# EasyEDA Pro project PCB2.eprj

# Board PCB2
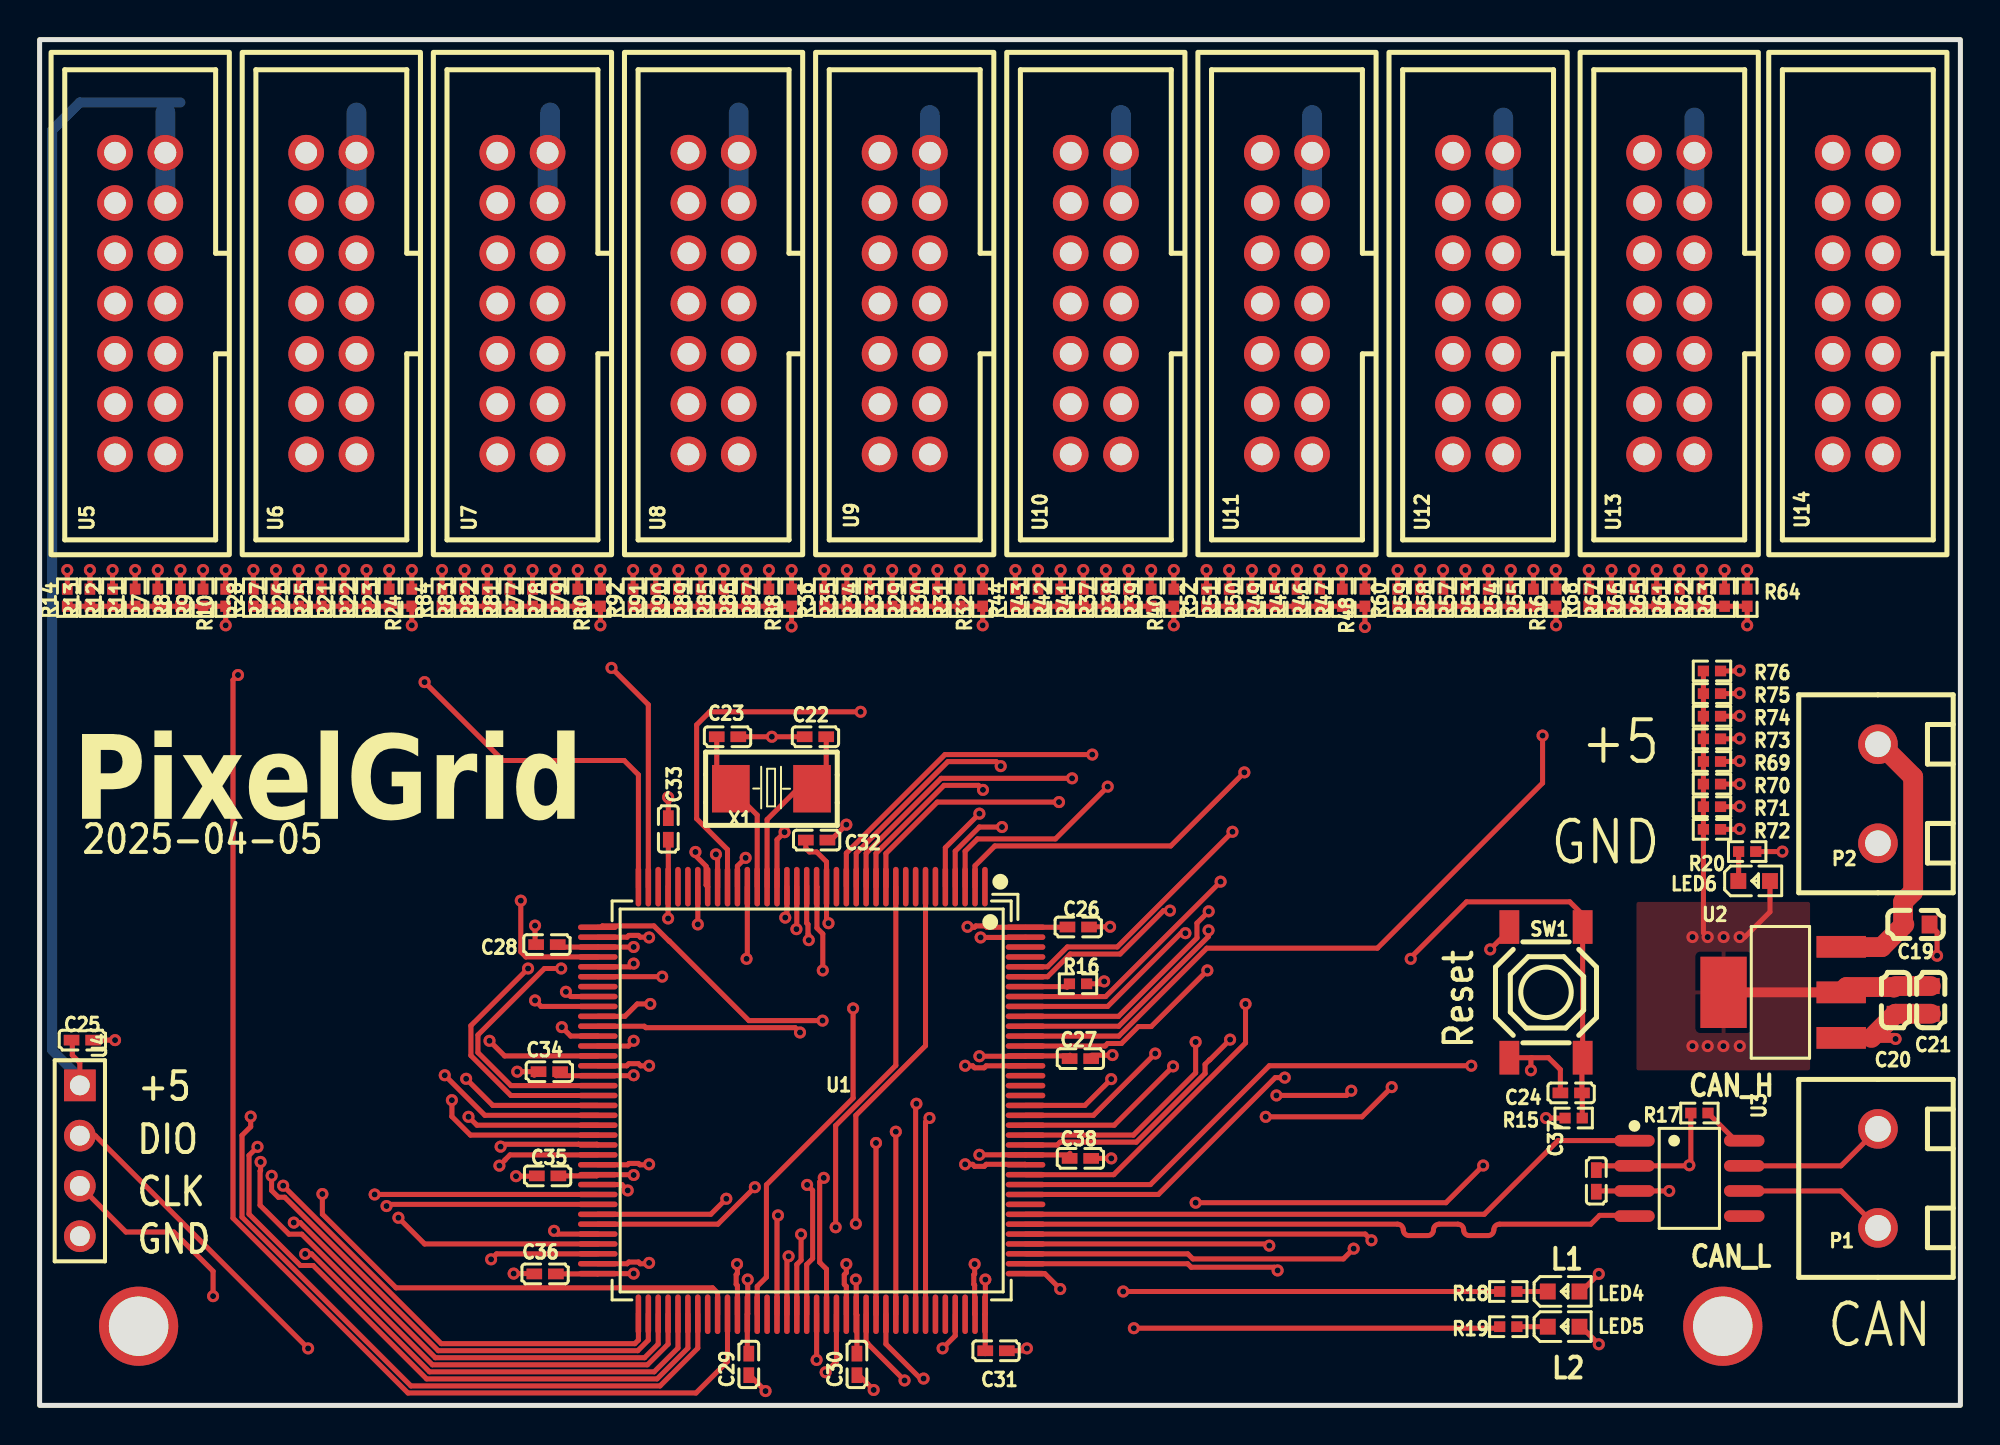
[diagram p0: board, top side]
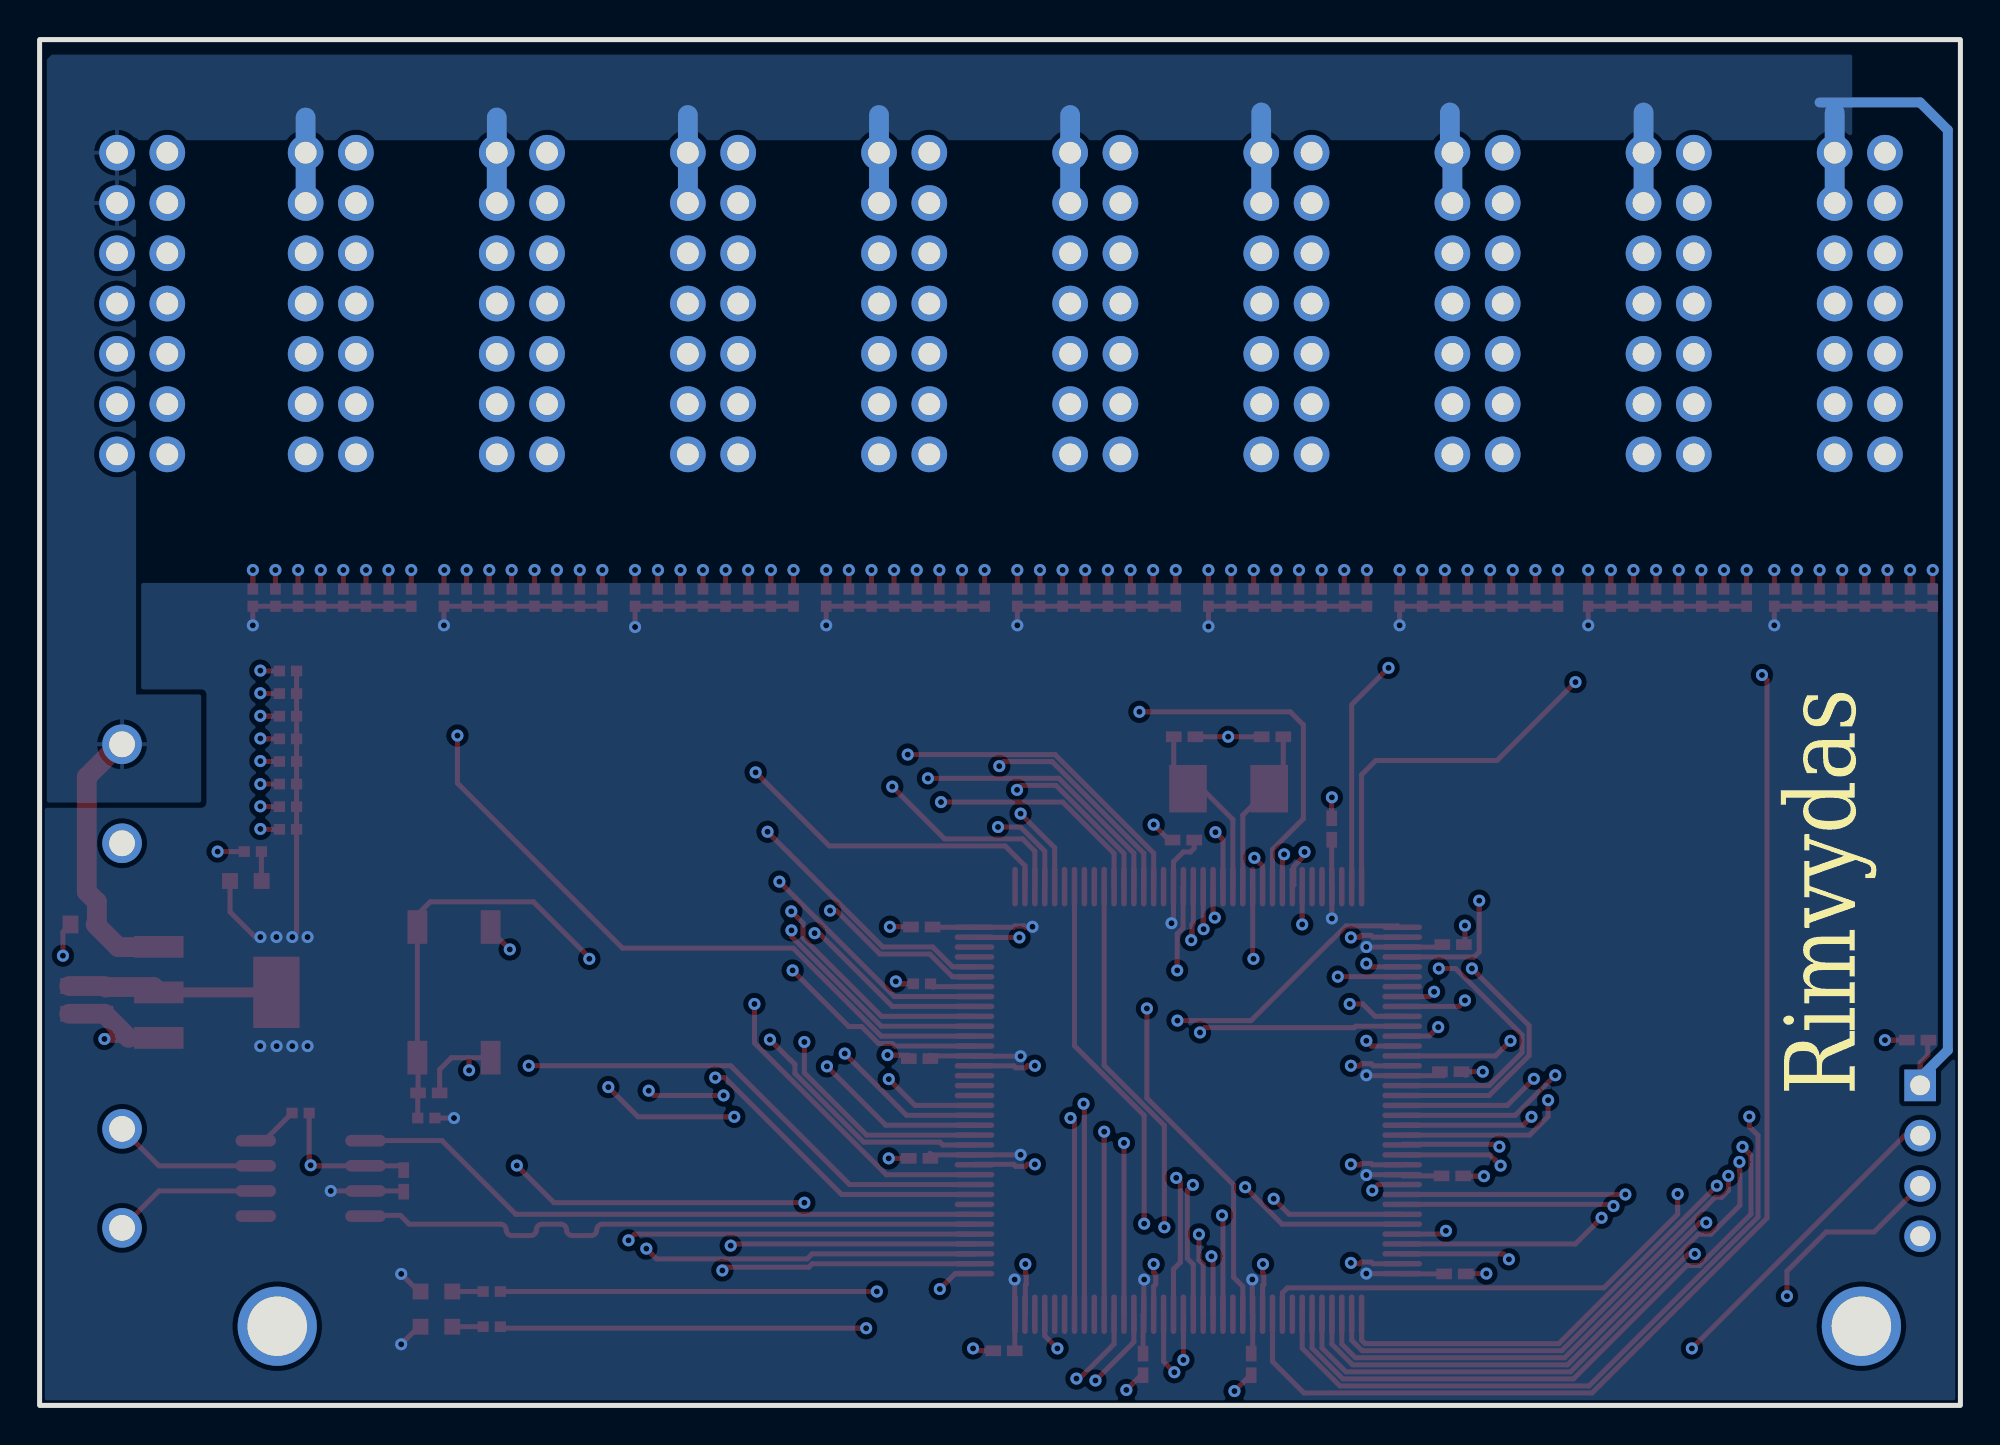
[diagram p1: board, bottom side, seen from below]

Outline 97 x 69 mm; copper layers: Top Layer, Inner1, Inner2, Bottom Layer. Coordinates in mm from the lower left corner of the outline.
Outline path: rectangle 0,69 97,0
Stack: Top Layer 0.035mm Outer layer copper thickness 1oz / Dielectric1 0.2104mm 7628 RC49% 8.6mil / Inner1 0.0152mm Inner layer copper thickness / Dielectric2 1.065mm 1.1mm H/HOZ Copper / Inner2 0.0152mm Inner layer copper thickness / Dielectric3 0.2104mm 7628 RC49% 8.6mil / Bottom Layer 0.035mm Outer layer copper thickness 1oz

## Design rules (mm)
template: JLCPCB Capability(Multiple Layers Board)
spacing copperThickness1oz (default): track to track 0.102, other pairs 0.152 to 0.3
spacing copperThickness2oz: track to track 0.203, other pairs 0.152 to 0.3
spacing copperThicknessInner0.5oz: track to track 0.089, other pairs 0.152 to 0.3
track width copperThickness1oz (default): min 0.102, default 0.254, max 2.54
track width copperThickness2oz: min 0.203, default 0.254, max 2.54
track width copperThickness0.5oz: min 0.089, default 0.254, max 2.54
differential pair differentialPair (default): width min 0.127, default 0.254, max 2.54; gap min 0.152, default 0.152
via viaSize (default): diameter min 0.3, default 0.61, max 10; hole min 0.2, default 0.305, max 6.3

## Placement (name value [footprint] x y rotation side)
C19  10uF  [C0603]  94.74 24.3 0 top
C20  10uF  [C0603]  93.73 20.49 90 top
C21  10uF  [C0603]  95.5 20.49 90 top
C22  20pF  [C0402]  39.18 33.78 0 top
C23  20pF  [C0402]  34.74 33.78 180 top
C24  100nF  [C0402]  77.34 15.79 0 top
C25  100nF  [C0402]  2.16 18.45 180 top
C26  100nF  [C0402]  52.45 24.17 180 top
C27  100nF  [C0402]  52.56 17.52 180 top
C28  100nF  [C0402]  25.62 23.28 0 top
C29  100nF  [C0402]  35.81 2.07 90 top
C30  100nF  [C0402]  41.28 2.07 90 top
C31  100nF  [C0402]  48.3 2.76 180 top
C32  100nF  [C0402]  39.24 28.56 180 top
C33  100nF  [C0402]  31.75 29.12 270 top
C34  100nF  [C0402]  25.74 16.86 0 top
C35  100nF  [C0402]  25.65 11.6 0 top
C36  100nF  [C0402]  25.53 6.64 0 top
C37  100nF  [C0402]  78.61 11.34 270 top
C38  100nF  [C0402]  52.56 12.48 180 top
LED4  KT-0603R  [LED0603-RD]  76.96 5.75 0 top
LED5  KT-0603R  [LED0603-RD]  76.96 3.98 0 top
LED6  KT-0603R  [LED0603-RD]  86.58 26.49 0 top
NOREF  -  [Pad_e2]  85 4 0 top
NOREF#2  -  [Pad_e4]  5 4 0 top
P1  WJ126V-5.0-2P  [CONN-TH_WJ126V-5.0-2P]  92.84 11.47 180 top
P2  WJ126V-5.0-2P  [CONN-TH_WJ126V-5.0-2P]  92.84 30.9 180 top
R7  2kΩ  [R0402]  5.97 40.81 270 top
R8  2kΩ  [R0402]  7.11 40.81 270 top
R9  2kΩ  [R0402]  8.25 40.81 270 top
R10  2kΩ  [R0402]  9.4 40.81 270 top
R11  2kΩ  [R0402]  4.83 40.81 270 top
R12  2kΩ  [R0402]  3.68 40.81 270 top
R13  2kΩ  [R0402]  2.54 40.81 270 top
R14  2kΩ  [R0402]  1.4 40.81 270 top
R15  10kΩ  [R0402]  77.47 14.52 180 top
R16  10kΩ  [R0402]  52.44 21.3 180 top
R17  10kΩ  [R0402]  83.82 14.77 180 top
R18  510Ω  [R0402]  74.17 5.75 0 top
R19  510Ω  [R0402]  74.17 3.98 0 top
R20  510Ω  [R0402]  86.23 27.98 180 top
R21  2kΩ  [R0402]  15.37 40.81 270 top
R22  2kΩ  [R0402]  16.51 40.81 270 top
R23  2kΩ  [R0402]  17.65 40.81 270 top
R24  2kΩ  [R0402]  18.8 40.81 270 top
R25  2kΩ  [R0402]  14.22 40.81 270 top
R26  2kΩ  [R0402]  13.08 40.81 270 top
R27  2kΩ  [R0402]  11.94 40.81 270 top
R28  2kΩ  [R0402]  10.8 40.81 270 top
R29  2kΩ  [R0402]  44.2 40.81 270 top
R30  2kΩ  [R0402]  45.34 40.81 270 top
R31  2kΩ  [R0402]  46.48 40.81 270 top
R32  2kΩ  [R0402]  47.62 40.81 270 top
R33  2kΩ  [R0402]  43.05 40.81 270 top
R34  2kΩ  [R0402]  41.91 40.81 270 top
R35  2kΩ  [R0402]  40.77 40.81 270 top
R36  2kΩ  [R0402]  39.62 40.81 270 top
R37  2kΩ  [R0402]  53.85 40.81 270 top
R38  2kΩ  [R0402]  54.99 40.81 270 top
R39  2kΩ  [R0402]  56.13 40.81 270 top
R40  2kΩ  [R0402]  57.28 40.81 270 top
R41  2kΩ  [R0402]  52.71 40.81 270 top
R42  2kΩ  [R0402]  51.56 40.81 270 top
R43  2kΩ  [R0402]  50.42 40.81 270 top
R44  2kΩ  [R0402]  49.28 40.81 270 top
R45  2kΩ  [R0402]  63.5 40.81 270 top
R46  2kΩ  [R0402]  64.64 40.81 270 top
R47  2kΩ  [R0402]  65.79 40.81 270 top
R48  2kΩ  [R0402]  66.93 40.81 270 top
R49  2kΩ  [R0402]  62.36 40.81 270 top
R50  2kΩ  [R0402]  61.21 40.81 270 top
R51  2kΩ  [R0402]  60.07 40.81 270 top
R52  2kΩ  [R0402]  58.93 40.81 270 top
R53  2kΩ  [R0402]  73.15 40.81 270 top
R54  2kΩ  [R0402]  74.29 40.81 270 top
R55  2kΩ  [R0402]  75.44 40.81 270 top
R56  2kΩ  [R0402]  76.58 40.81 270 top
R57  2kΩ  [R0402]  72.01 40.81 270 top
R58  2kΩ  [R0402]  70.87 40.81 270 top
R59  2kΩ  [R0402]  69.72 40.81 270 top
R60  2kΩ  [R0402]  68.58 40.81 270 top
R61  2kΩ  [R0402]  82.8 40.81 270 top
R62  2kΩ  [R0402]  83.95 40.81 270 top
R63  2kΩ  [R0402]  85.09 40.81 270 top
R64  2kΩ  [R0402]  86.23 40.81 270 top
R65  2kΩ  [R0402]  81.66 40.81 270 top
R66  2kΩ  [R0402]  80.52 40.81 270 top
R67  2kΩ  [R0402]  79.38 40.81 270 top
R68  2kΩ  [R0402]  78.23 40.81 270 top
R69  2kΩ  [R0402]  84.46 32.53 180 top
R70  2kΩ  [R0402]  84.46 31.39 180 top
R71  2kΩ  [R0402]  84.46 30.25 180 top
R72  2kΩ  [R0402]  84.46 29.1 180 top
R73  2kΩ  [R0402]  84.46 33.67 180 top
R74  2kΩ  [R0402]  84.46 34.82 180 top
R75  2kΩ  [R0402]  84.46 35.96 180 top
R76  2kΩ  [R0402]  84.46 37.1 180 top
R77  2kΩ  [R0402]  24.89 40.81 270 top
R78  2kΩ  [R0402]  26.03 40.81 270 top
R79  2kΩ  [R0402]  27.18 40.81 270 top
R80  2kΩ  [R0402]  28.32 40.81 270 top
R81  2kΩ  [R0402]  23.75 40.81 270 top
R82  2kΩ  [R0402]  22.61 40.81 270 top
R83  2kΩ  [R0402]  21.46 40.81 270 top
R84  2kΩ  [R0402]  20.32 40.81 270 top
R85  2kΩ  [R0402]  34.54 40.81 270 top
R86  2kΩ  [R0402]  35.69 40.81 270 top
R87  2kΩ  [R0402]  36.83 40.81 270 top
R88  2kΩ  [R0402]  37.97 40.81 270 top
R89  2kΩ  [R0402]  33.4 40.81 270 top
R90  2kΩ  [R0402]  32.26 40.81 270 top
R91  2kΩ  [R0402]  31.12 40.81 270 top
R92  2kΩ  [R0402]  29.97 40.81 270 top
SW1  TS-1187A-B-A-B  [SW-SMD_4P-L5.1-W5.1-P3.70-LS6.5-TL-2]  76.07 20.87 90 top
U1  STM32F103ZET6  [LQFP-144_L20.0-W20.0-P0.50-LS22.0-BL]  38.99 15.41 180 top
U2  AMS1117-3.3  [SOT-223-3_L6.5-W3.4-P2.30-LS7.0-BR]  88.01 20.87 0 top
U3  SN65HVD230DR  [SOIC-8_L4.9-W3.9-P1.27-LS6.0-BL]  83.31 11.47 270 top
U4  HDGCPH-PZ01-04  [HDR-TH_4P-P2.54-V-M_1]  2.03 12.36 270 top
U5  HY2541WV-N-2X7P  [HDR-TH_14P-P2.54-V-F-R2-C7-S2.54-2]  5.08 55.67 90 top
U6  HY2541WV-N-2X7P  [HDR-TH_14P-P2.54-V-F-R2-C7-S2.54-2]  14.73 55.67 90 top
U7  HY2541WV-N-2X7P  [HDR-TH_14P-P2.54-V-F-R2-C7-S2.54-2]  24.38 55.67 90 top
U8  HY2541WV-N-2X7P  [HDR-TH_14P-P2.54-V-F-R2-C7-S2.54-2]  34.04 55.67 90 top
U9  HY2541WV-N-2X7P  [HDR-TH_14P-P2.54-V-F-R2-C7-S2.54-2]  43.69 55.67 90 top
U10  HY2541WV-N-2X7P  [HDR-TH_14P-P2.54-V-F-R2-C7-S2.54-2]  53.34 55.67 90 top
U11  HY2541WV-N-2X7P  [HDR-TH_14P-P2.54-V-F-R2-C7-S2.54-2]  62.99 55.67 90 top
U12  HY2541WV-N-2X7P  [HDR-TH_14P-P2.54-V-F-R2-C7-S2.54-2]  72.64 55.67 90 top
U13  HY2541WV-N-2X7P  [HDR-TH_14P-P2.54-V-F-R2-C7-S2.54-2]  82.3 55.67 90 top
U14  HY2541WV-N-2X7P  [HDR-TH_14P-P2.54-V-F-R2-C7-S2.54-2]  91.82 55.67 90 top
X1  8MHz  [CRYSTAL-SMD_L5.0-W3.2]  36.96 31.15 180 top

## Footprints (pads in the part's own frame, mm; a bottom-side part is the same pattern mirrored in y, then rotated)
C0402
  rect 0.79x0.54 smd: 1(-0.545,0) 2(0.545,0)
C0603
  rect 0.8x0.9 smd: 1(-0.7,0) 2(0.7,0)
CONN-TH_WJ126V-5.0-2P
  round 2 hole 1.3: 1(0,2.501) 2(0,-2.501)
CRYSTAL-SMD_L5.0-W3.2
  rect 1.9x2.4 smd: 1(-2.05,0) 2(2.05,0)
HDR-TH_4P-P2.54-V-M_1
  rect 1.6x1.6 hole 1: 1(-3.81,0)
  round 1.6 hole 1: 2(-1.27,0) 3(1.27,0) 4(3.81,0)
HDR-TH_14P-P2.54-V-F-R2-C7-S2.54-2
  round 1.8 hole 1.1: 1(-7.62,-1.27) 2(-7.62,1.27) 3(-5.08,-1.27) 4(-5.08,1.27) 5(-2.54,-1.27) 6(-2.54,1.27) 7(0,-1.27) 8(0,1.27) 9(2.54,-1.27) 10(2.54,1.27) 11(5.08,-1.27) 12(5.08,1.27) 13(7.62,-1.27) 14(7.62,1.27)
LED0603-RD
  rect 0.8x0.8 smd: 1(-0.799,0) 2(0.799,0)
LQFP-144_L20.0-W20.0-P0.50-LS22.0-BL
  oval 0.28x2 smd: 1(-8.75,-10.8) 2(-8.25,-10.8) 3(-7.75,-10.8) 4(-7.25,-10.8) 5(-6.75,-10.8) 6(-6.25,-10.8) 7(-5.75,-10.8) 8(-5.25,-10.8) 9(-4.75,-10.8) 10(-4.25,-10.8) 11(-3.75,-10.8) 12(-3.25,-10.8) 13(-2.75,-10.8) 14(-2.25,-10.8) 15(-1.75,-10.8) 16(-1.25,-10.8) 17(-0.75,-10.8) 18(-0.25,-10.8) 19(0.25,-10.8) 20(0.75,-10.8) 21(1.25,-10.8) 22(1.75,-10.8) 23(2.25,-10.8) 24(2.75,-10.8) 25(3.25,-10.8) 26(3.75,-10.8) 27(4.25,-10.8) 28(4.75,-10.8) 29(5.25,-10.8) 30(5.75,-10.8) 31(6.25,-10.8) 32(6.75,-10.8) 33(7.25,-10.8) 34(7.75,-10.8) 35(8.25,-10.8) 36(8.75,-10.8) 73(8.75,10.8) 74(8.25,10.8) 75(7.75,10.8) 76(7.25,10.8) 77(6.75,10.8) 78(6.25,10.8) 79(5.75,10.8) 80(5.25,10.8) 81(4.75,10.8) 82(4.25,10.8) 83(3.75,10.8) 84(3.25,10.8) 85(2.75,10.8) 86(2.25,10.8) 87(1.75,10.8) 88(1.25,10.8) 89(0.75,10.8) 90(0.25,10.8) 91(-0.25,10.8) 92(-0.75,10.8) 93(-1.25,10.8) 94(-1.75,10.8) 95(-2.25,10.8) 96(-2.75,10.8) 97(-3.25,10.8) 98(-3.75,10.8) 99(-4.25,10.8) 100(-4.75,10.8) 101(-5.25,10.8) 102(-5.75,10.8) 103(-6.25,10.8) 104(-6.75,10.8) 105(-7.25,10.8) 106(-7.75,10.8) 107(-8.25,10.8) 108(-8.75,10.8)
  oval 2x0.28 smd: 37(10.8,-8.75) 38(10.8,-8.25) 39(10.8,-7.75) 40(10.8,-7.25) 41(10.8,-6.75) 42(10.8,-6.25) 43(10.8,-5.75) 44(10.8,-5.25) 45(10.8,-4.75) 46(10.8,-4.25) 47(10.8,-3.75) 48(10.8,-3.25) 49(10.8,-2.75) 50(10.8,-2.25) 51(10.8,-1.75) 52(10.8,-1.25) 53(10.8,-0.75) 54(10.8,-0.25) 55(10.8,0.25) 56(10.8,0.75) 57(10.8,1.25) 58(10.8,1.75) 59(10.8,2.25) 60(10.8,2.75) 61(10.8,3.25) 62(10.8,3.75) 63(10.8,4.25) 64(10.8,4.75) 65(10.8,5.25) 66(10.8,5.75) 67(10.8,6.25) 68(10.8,6.75) 69(10.8,7.25) 70(10.8,7.75) 71(10.8,8.25) 72(10.8,8.75) 109(-10.8,8.75) 110(-10.8,8.25) 111(-10.8,7.75) 112(-10.8,7.25) 113(-10.8,6.75) 114(-10.8,6.25) 115(-10.8,5.75) 116(-10.8,5.25) 117(-10.8,4.75) 118(-10.8,4.25) 119(-10.8,3.75) 120(-10.8,3.25) 121(-10.8,2.75) 122(-10.8,2.25) 123(-10.8,1.75) 124(-10.8,1.25) 125(-10.8,0.75) 126(-10.8,0.25) 127(-10.8,-0.25) 128(-10.8,-0.75) 129(-10.8,-1.25) 130(-10.8,-1.75) 131(-10.8,-2.25) 132(-10.8,-2.75) 133(-10.8,-3.25) 134(-10.8,-3.75) 135(-10.8,-4.25) 136(-10.8,-4.75) 137(-10.8,-5.25) 138(-10.8,-5.75) 139(-10.8,-6.25) 140(-10.8,-6.75) 141(-10.8,-7.25) 142(-10.8,-7.75) 143(-10.8,-8.25) 144(-10.8,-8.75)
Pad_e2
  round 4 hole 3: 1(0,0)
Pad_e4
  round 4 hole 3: 1(0,0)
R0402
  rect 0.566x0.54 smd: 1(-0.433,0) 2(0.433,0)
SOIC-8_L4.9-W3.9-P1.27-LS6.0-BL
  oval 0.588x2.045 smd: 1(-1.905,-2.772) 2(-0.635,-2.772) 3(0.635,-2.772) 4(1.905,-2.772) 5(1.905,2.772) 6(0.635,2.772) 7(-0.635,2.772) 8(-1.905,2.772)
SOT-223-3_L6.5-W3.4-P2.30-LS7.0-BR
  rect 2.5x1.1 smd: 1(2.97,-2.3) 2(2.97,0) 3(2.97,2.3)
  rect 2.34x3.6 smd: 4(-2.97,0)
SW-SMD_4P-L5.1-W5.1-P3.70-LS6.5-TL-2
  rect 1.7x1 smd: 1(-3.3,1.85) 2(3.3,1.85) 3(-3.3,-1.85) 4(3.3,-1.85)

## Nets
GND: C19.2 C20.1 C21.1 C22.1 C23.1 C24.1 C25.1 C26.1 C27.1 C28.1 C29.1 C30.1 C31.1 C32.1 C33.1 C34.1 C35.1 C36.1 C37.1 C38.1 P2.1 R16.1 R17.2 R20.1 SW1.1 SW1.2 U1.30 U1.38 U1.51 U1.61 U1.71 U1.83 U1.94 U1.107 U1.120 U1.130 U1.143 U2.1 U3.2 U4.4 U5.12 U5.14 U6.12 U6.14 U7.12 U7.14 U8.12 U8.14 U9.12 U9.14 U10.12 U10.14 U11.12 U11.14 U12.12 U12.14 U13.12 U13.14 U14.12 U14.14
VCC3V3: C20.2 C21.2 C26.2 C27.2 C28.2 C29.2 C30.2 C31.2 C32.2 C33.2 C34.2 C35.2 C36.2 C37.2 C38.2 LED4.2 LED5.2 LED6.2 R7.2 R8.2 R9.2 R10.2 R11.2 R12.2 R13.2 R14.2 R15.2 R21.2 R22.2 R23.2 R24.2 R25.2 R26.2 R27.2 R28.2 R29.2 R30.2 R31.2 R32.2 R33.2 R34.2 R35.2 R36.2 R37.2 R38.2 R39.2 R40.2 R41.2 R42.2 R43.2 R44.2 R45.2 R46.2 R47.2 R48.2 R49.2 R50.2 R51.2 R52.2 R53.2 R54.2 R55.2 R56.2 R57.2 R58.2 R59.2 R60.2 R61.2 R62.2 R63.2 R64.2 R65.2 R66.2 R67.2 R68.2 R69.2 R70.2 R71.2 R72.2 R73.2 R74.2 R75.2 R76.2 R77.2 R78.2 R79.2 R80.2 R81.2 R82.2 R83.2 R84.2 R85.2 R86.2 R87.2 R88.2 R89.2 R90.2 R91.2 R92.2 U1.17 U1.33 U1.39 U1.52 U1.62 U1.72 U1.84 U1.95 U1.108 U1.121 U1.131 U1.144 U2.2 U2.4 U3.3
VCC5V: C19.1 C25.2 P2.2 U2.3 U4.1 U5.11 U5.13 U6.11 U6.13 U7.11 U7.13 U8.11 U8.13 U9.11 U9.13 U10.11 U10.13 U11.11 U11.13 U12.11 U12.13 U13.11 U13.13 U14.11 U14.13
BOOT0: R16.2 U1.138
CAN_RX: U1.114 U3.4
CAN_TX: U1.115 U3.1
L1_IN: U1.82 U5.9
L1_OUT: U5.10
L2_IN: U1.36 U6.9
L2_OUT: U6.10
L3_IN: U1.35 U7.9
L3_OUT: U7.10
L4_IN: U1.42 U8.9
L4_OUT: U8.10
L5_IN: U1.46 U9.9
L5_OUT: U9.10
L6_IN: U1.47 U10.9
L6_OUT: U10.10
L7_IN: U1.85 U11.9
L7_OUT: U11.10
L8_IN: U1.37 U12.9
L8_OUT: U12.10
L9_IN: U1.99 U13.9
L9_OUT: U13.10
L10_IN: U1.96 U14.9
L10_OUT: U14.10
LED1: R18.1 U1.7
LED2: R19.1 U1.10
OSC_IN: C22.2 U1.23 X1.1
OSC_OUT: C23.2 U1.24 X1.2
R1_1: R10.1 U1.81 U5.7
R1_2: R14.1 U1.79 U5.8
R2_1: R9.1 U1.77 U5.5
R2_2: R13.1 U1.78 U5.6
R3_1: R8.1 U1.75 U5.3
R3_2: R12.1 U1.76 U5.4
R4_1: R7.1 U1.73 U5.1
R4_2: R11.1 U1.74 U5.2
R5_1: R24.1 U1.87 U6.7
R5_2: R28.1 U1.88 U6.8
R6_1: R23.1 U1.89 U6.5
R6_2: R27.1 U1.70 U6.6
R7_1: R22.1 U1.69 U6.3
R7_2: R26.1 U1.68 U6.4
R8_1: R21.1 U1.65 U6.1
R8_2: R25.1 U1.64 U6.2
R9_1: R80.1 U1.63 U7.7
R9_2: R84.1 U1.60 U7.8
R10_1: R79.1 U1.59 U7.5
R10_2: R83.1 U1.58 U7.6
R11_1: R78.1 U1.57 U7.3
R11_2: R82.1 U1.56 U7.4
R12_1: R77.1 U1.55 U7.1
R12_2: R81.1 U1.50 U7.2
R13_1: R88.1 U1.49 U8.7
R13_2: R92.1 U1.48 U8.8
R14_1: R87.1 U1.41 U8.5
R14_2: R91.1 U1.40 U8.6
R15_1: R86.1 U1.44 U8.3
R15_2: R90.1 U1.45 U8.4
R16_1: R85.1 U1.53 U8.1
R16_2: R89.1 U1.54 U8.2
R17_1: R32.1 U1.19 U9.7
R17_2: R36.1 U1.20 U9.8
R18_1: R31.1 U1.21 U9.5
R18_2: R35.1 U1.22 U9.6
R19_1: R30.1 U1.26 U9.3
R19_2: R34.1 U1.27 U9.4
R20_1: R29.1 U1.28 U9.1
R20_2: R33.1 U1.29 U9.2
R21_1: R40.1 U1.15 U10.7
R21_2: R44.1 U1.18 U10.8
R22_1: R39.1 U1.13 U10.5
R22_2: R43.1 U1.14 U10.6
R23_1: R38.1 U1.11 U10.3
R23_2: R42.1 U1.12 U10.4
R24_1: R37.1 U1.4 U10.1
R24_2: R41.1 U1.5 U10.2
R25_1: R48.1 U1.2 U11.7
R25_2: R52.1 U1.3 U11.8
R26_1: R47.1 U1.140 U11.5
R26_2: R51.1 U1.139 U11.6
R27_1: R46.1 U1.137 U11.3
R27_2: R50.1 U1.136 U11.4
R28_1: R45.1 U1.135 U11.1
R28_2: R49.1 U1.134 U11.2
R29_1: R56.1 U1.133 U12.7
R29_2: R60.1 U1.132 U12.8
R30_1: R55.1 U1.126 U12.5
R30_2: R59.1 U1.125 U12.6
R31_1: R54.1 U1.124 U12.3
R31_2: R58.1 U1.123 U12.4
R32_1: R53.1 U1.122 U12.1
R32_2: R57.1 U1.119 U12.2
R33_1: R64.1 U1.118 U13.7
R33_2: R68.1 U1.117 U13.8
R34_1: R63.1 U1.113 U13.5
R34_2: R67.1 U1.112 U13.6
R35_1: R62.1 U1.111 U13.3
R35_2: R66.1 U1.110 U13.4
R36_1: R61.1 U1.102 U13.1
R36_2: R65.1 U1.101 U13.2
R37_1: R72.1 U1.98 U14.7
R37_2: R76.1 U1.97 U14.8
R38_1: R71.1 U1.93 U14.5
R38_2: R75.1 U1.92 U14.6
R39_1: R70.1 U1.91 U14.3
R39_2: R74.1 U1.90 U14.4
R40_1: R69.1 U1.66 U14.1
R40_2: R73.1 U1.67 U14.2
RESET: C24.2 R15.1 SW1.3 SW1.4 U1.25
SWCLK: U1.109 U4.3
SWDIO: U1.105 U4.2
$2N2: R17.1 U3.8
$2N4: P1.2 U3.7
$2N5: P1.1 U3.6
$2N12387: LED4.1 R18.2
$2N12392: LED5.1 R19.2
$2N12397: LED6.1 R20.2

Pads without a net: NOREF 1; NOREF#2 1; U1 1 6 8 9 16 31 32 34 43 80 86 100 103 104 106 116 127 128 129 141 142; U3 5

## Via types
v1: diameter 0.61, hole 0.305, Top Layer to Bottom Layer, 251 vias

## Routing (per net, layer and track width the routed paths; a pad name or vN(x,y) marks a point on that pad's centre or on a via; arc(x,y) is an arc through that point)
GND: length 70.4
  Top Layer w0.254: v1(95.82,22.72) 95.82,23.92 C19.2 ; v1(30.78,23.64) 30.76,23.66 30.33,23.66 30.24,23.74 29.76,23.74 29.67,23.66 U1.38 ; C23.1 36.84,33.78 ; v1(24.12,16.86) 24.98,16.86 24.98,16.68 ; 75.35,17.56 76.2,17.56 76.8,16.97 C24.1 ; 75.35,17.56 74.22,17.56 SW1.1 ; 75.35,17.56 75.31,17.53 v1(75.31,16.93) ; 25.11,23.15 25.02,23.24 v1(25.02,24.24) ; v1(42.12,0.78) 41.37,1.53 C30.1 ; C31.1 49.74,2.76 v1(49.86,2.88) ; v1(40.74,7.14) 40.74,6.71 40.64,6.6 40.64,6.12 40.74,6.01 40.74,4.61 ; U1.51 29.65,17.16 29.76,17.26 30.24,17.26 30.35,17.16 30.78,17.16 v1(30.78,17.16) ; C36.1 24.97,6.66 v1(23.94,6.66) ; U1.83 35.24,6.06 35.18,6.12 35.18,6.6 35.24,6.66 35.24,7.12 v1(35.22,7.14) ; v1(73.25,23.04) 74.22,24 SW1.2 ; v1(54.18,17.7) 54.17,17.69 53.12,17.69 ; 49.79,23.66 49.77,23.64 v1(47.52,23.64) ; C35.1 25.09,11.58 v1(24.06,11.58) ; C33.1 31.75,30.71 v1(31.74,30.72) ; v1(30.78,7.2) 30.74,7.16 30.33,7.16 30.24,7.24 29.76,7.24 29.67,7.16 U1.71 ; C37.1 78.83,12.1 U3.2 83.28,12.1 v1(83.31,12.13) 83.39,12.21 R17.2 ; C38.1 v1(54.12,12.48) ; v1(36.66,0.72) 35.86,1.53 C29.1 ; C22.1 v1(36.98,33.78) ; 49.79,12.16 49.76,12.18 47.81,12.18 47.7,12.08 47.22,12.08 47.11,12.18 v1(46.74,12.18) ; v1(3.81,18.45) C25.1 ; v1(40.74,29.34) 39.96,28.56 C32.1 ; R16.1 53.64,21.3 v1(53.76,21.42) ; 33.24,26.2 v1(33.24,24.3) ; v1(30.78,12.18) 30.76,12.16 30.31,12.16 30.24,12.22 29.76,12.22 29.69,12.16 U1.61 ; R20.1 v1(88.01,27.98) ; 49.79,17.16 47.8,17.16 47.7,17.06 47.22,17.06 47.12,17.16 46.74,17.16 v1(46.74,17.16) ; v1(47.22,7.14) 47.22,6.65 47.18,6.6 47.18,6.12 47.22,6.07 47.22,4.62 U1.107 ; C26.1 53.01,24.18 v1(54.06,24.18)
  Top Layer w0.5: v1(93.73,18.51) 93.67,18.57 U2.1
  Top Layer w1: C21.1 C20.1 92.51,18.57
VCC3V3: length 165.6
  Top Layer w0.254: R76.2 84.02,23.88 v1(84.24,23.66) ; v1(35.76,6.36) 35.76,4.63 U1.84 35.74,2.69 C29.2 ; v1(86.23,39.41) R64.2 R63.2 R62.2 R61.2 R65.2 R66.2 R67.2 R68.2 ; C32.2 38.69,28.14 38.88,27.96 39.24,27.96 39.74,27.46 U1.17 39.74,24.46 v1(39.84,24.36) ; 47.75,2.62 47.75,4.59 U1.108 47.76,4.63 v1(47.76,6.36) ; v1(76.58,39.41) R56.2 R55.2 R54.2 R53.2 R57.2 R58.2 R59.2 R60.2 ; C35.2 28.13,11.6 U1.62 29.98,11.66 v1(30,11.64) ; R92.2 R91.2 R90.2 R89.2 R85.2 R86.2 R87.2 R88.2 37.97,39.54 ; R28.2 R27.2 R26.2 R25.2 R21.2 R22.2 R23.2 R24.2 v1(18.8,39.41) ; v1(46.86,24.18) 46.88,24.16 47.21,24.16 47.28,24.22 47.76,24.22 47.83,24.16 51.89,24.16 C26.2 ; LED4.2 77.85,5.75 v1(78.74,6.64) ; v1(28.32,39.41) R80.2 R79.2 R78.2 R77.2 R81.2 R82.2 R83.2 R84.2 ; R14.2 R13.2 R12.2 R11.2 R7.2 R8.2 R9.2 R10.2 v1(9.4,39.41) ; v1(41.22,6.36) 41.24,6.34 U1.95 41.28,4.57 C30.2 ; 26.07,16.68 26.09,16.66 U1.52 29.98,16.66 v1(30,16.68) ; v1(57.28,39.41) R40.2 R39.2 R38.2 R37.2 R41.2 R42.2 R43.2 R44.2 ; LED6.2 87.38,24.93 86.11,23.66 v1(85.85,23.66) ; 66.93,39.54 R48.2 R47.2 R46.2 R45.2 R49.2 R50.2 R51.2 R52.2 ; v1(78.74,3.09) 77.85,3.98 LED5.2 ; C33.2 31.75,26.22 U1.33 ; C37.2 78.65,10.83 U3.3 v1(82.3,10.83) ; v1(47.46,17.64) 49.77,17.64 49.79,17.66 52,17.66 52.03,17.69 ; v1(30,6.66) 30,6.66 U1.72 28.18,6.64 C36.2 ; v1(47.62,39.41) R32.2 R31.2 R30.2 R29.2 R33.2 R34.2 R35.2 R36.2 ; v1(30,23.16) 30,23.16 U1.39 28.19,23.15 26.2,23.15 ; R15.2 v1(76.07,14.52) ; 52.03,12.74 51.95,12.66 49.79,12.66 49.78,12.66 v1(47.46,12.66) ; v1(31.74,24.6) 31.74,26.2
  Top Layer w0.5: U2.4 U2.2 ; C20.2 93.65,21.11
  Top Layer w1: 93.65,21.11 93.62,21.14 91.25,21.14 U2.2 ; C21.2 C20.2
  vias: v1(37.97,39.35) v1(66.93,39.32) v1(83.47,23.66) v1(83.47,18.15) v1(84.24,18.15) v1(85.04,23.66) v1(85.03,18.15) v1(85.86,18.15)
VCC5V: length 112.5
  Top Layer w0.254: U4.1 2.03,17.31 1.65,17.69 1.65,18.56 1.67,18.58
  Top Layer w1: U2.3 91,23.15 93.03,23.15 94.17,24.3 ; P2.2 92.96,33.4 94.62,31.75 94.62,25.95 94.11,25.44 94.11,24.36
  Bottom Layer w0.5: 7.11,65.83 2.03,65.83 0.64,64.43 0.64,17.95 1.91,16.68 1.91,16.3 U4.1
  Bottom Layer w1: U10.11 54.61,65.19 ; U6.11 16,65.32 ; U11.11 64.26,65.19 ; 83.57,65.06 U13.11 ; U7.11 25.65,63.28 25.78,63.41 25.78,65.32 ; 44.96,65.19 U9.11 ; 35.31,65.32 U8.11 ; U12.11 73.91,65.06 ; U5.11 6.35,65.32
BOOT0: length 2.1
  Top Layer w0.254: 49.79,21.16 51.86,21.16 51.89,21.12
CAN_RX: length 32.3
  Top Layer w0.254: U3.4 80.5,9.6 78.78,9.6 78.34,9.16 73.73,9.16 arc(73.52,9.07) 73.44,8.87 arc(73.35,8.66) 73.15,8.58 72.2,8.58 arc(72,8.66) 71.91,8.87 arc(71.83,9.07) 71.63,9.16 70.68,9.16 arc(70.47,9.07) 70.39,8.87 arc(70.31,8.66) 70.1,8.58 69.15,8.58 arc(68.95,8.66) 68.87,8.87 arc(68.78,9.07) 68.58,9.16 49.79,9.16
CAN_TX: length 32.3
  Top Layer w0.254: U3.1 80.53,13.38 76.68,13.38 72.96,9.66 49.79,9.66
L1_IN: length 82.2
  Top Layer w0.254: U1.82 34.74,2.22 33.15,0.63 18.6,0.63 9.77,9.47 9.77,36.65 v1(10.02,36.9)
  Inner1 w0.254: v1(10.02,36.9) 9.98,36.94 9.98,54.83 6.6,58.2 6.35,58.2
L2_IN: length 41.5
  Top Layer w0.254: v1(19.44,36.54) 23.4,32.58 29.52,32.58 30.24,31.86 U1.36
  Inner1 w0.254: 16,58.2 19.38,54.83 19.38,36.6 v1(19.44,36.54)
L3_IN: length 34.2
  Top Layer w0.254: v1(28.88,37.26) 30.74,35.4 U1.35
  Inner1 w0.254: 25.65,58.2 28.96,54.9 28.96,37.34 v1(28.88,37.26)
L4_IN: length 45.8
  Top Layer w0.254: v1(31.44,21.66) 28.19,21.66 U1.42
  Inner1 w0.254: v1(31.44,21.66) 32.4,22.62 32.4,25.02 31.08,26.34 31.08,32.42 33.57,34.92 34.36,34.92 38.74,39.29 38.74,54.78 35.31,58.2
L5_IN: length 53
  Top Layer w0.254: v1(30.84,20.28) 30.18,20.28 29.56,19.66 U1.46
  Inner1 w0.254: v1(30.84,20.28) 35.02,20.28 37.66,22.92 39.73,22.92 40.78,23.97 40.78,26.04 48.21,33.47 48.21,54.95 44.96,58.2
L6_IN: length 61.2
  Top Layer w0.254: U1.47 30.54,19.16 30.61,19.08 38.16,19.08 v1(38.4,18.84)
  Inner1 w0.254: 54.61,58.2 57.91,54.9 57.91,36.06 50.49,28.64 47.04,28.64 38.4,20 v1(38.4,18.84)
L7_IN: length 77
  Top Layer w0.254: U1.85 36.24,6.01 36.7,6.48 36.7,11.14 41.08,15.52 v1(41.08,20.05)
  Inner1 w0.254: 64.13,58.2 67.56,54.78 67.56,41.19 ; v1(41.08,20.05) 41.4,20.38 56.49,20.38 67.56,31.44 67.56,41.34
L8_IN: length 85.8
  Top Layer w0.254: v1(39.54,19.44) 35.82,19.44 31.8,23.46 31.79,23.46 31.02,24.22 28.42,24.22 28.35,24.16 U1.37
  Inner1 w0.254: 73.79,58.2 77.16,54.84 77.16,41.06 ; 77.16,41.1 77.16,41.09 77.16,39.17 77.16,39.16 77.16,33.6 59.46,15.9 43.08,15.9 v1(39.54,19.44)
L9_IN: length 96
  Top Layer w0.254: v1(72.9,12.12) 71.02,10.24 v1(58.38,10.24) ; U1.99 v1(43.24,13.83)
  Inner1 w0.254: 83.57,58.33 86.94,54.96 86.94,41.87 ; v1(72.9,12.12) 72.93,12.14 72.93,19.68 72.67,19.93 72.67,24.58 80.36,32.27 80.36,37.43 82.79,39.85 84.91,39.85 86.94,41.88 ; v1(43.24,13.83) 54.79,13.83 v1(58.38,10.24)
L10_IN: length 100.6
  Top Layer w0.254: U1.96 41.74,3.21 41.82,3.13 41.82,3.12 v1(43.68,1.26)
  Inner1 w0.254: v1(43.68,1.26) 44.17,0.77 58.56,0.77 61.18,3.39 71.39,3.39 80.7,12.69 80.7,26.01 82.94,28.26 85.92,28.26 90.19,32.53 90.19,41.58 95.45,46.84 95.45,55.85 93.09,58.2
LED1: length 52.4
  Top Layer w0.254: U1.7 44.74,18.17 41.22,14.65 v1(41.22,9.18) ; R18.1 v1(54.72,5.75)
  Inner1 w0.254: v1(41.22,9.18) 51.29,9.18 v1(54.72,5.75)
LED2: length 54.1
  Top Layer w0.254: U1.10 43.24,17.18 40.2,14.14 v1(40.2,9) ; R19.1 73.66,3.9 v1(55.26,3.9)
  Inner1 w0.254: v1(55.26,3.9) 51,8.16 41.04,8.16 v1(40.2,9)
OSC_IN: length 9.2
  Top Layer w0.254: C22.2 39.72,31.87 X1.1 38.29,31.15 36.74,29.6 U1.23
OSC_OUT: length 8.4
  Top Layer w0.254: U1.24 36.24,29.82 34.19,31.87 C23.2
R1_1: length 73.5
  Top Layer w0.254: U1.81 34.24,5.69 33.99,5.94 18,5.94 14.28,9.66 v1(14.28,10.68) ; R10.1 v1(9.4,42.2)
  Inner1 w0.254: U5.7 8.89,53.12 8.89,42.2 ; v1(14.28,10.68) 14.28,11.97 13.38,12.87 13.38,25.08 8.89,29.57 8.89,39.09 8.81,39.17 8.81,39.65 8.89,39.73 8.89,42.2 ; 8.89,42.2 v1(9.4,42.2)
R1_2: length 82.3
  Top Layer w0.254: v1(10.66,14.59) 10.66,14.08 10.22,13.64 10.22,9.51 18.75,0.98 31.33,0.98 33.24,2.89 U1.79 ; R14.1 v1(1.4,42.2)
  Inner1 w0.254: 10.89,23.88 10.89,16.44 10.66,16.21 v1(10.66,14.59) ; 0.89,42.2 0.89,34.05 10.89,24.05 10.89,23.89 ; 0.89,42.2 0.89,52.74 U5.8 ; 0.89,42.2 v1(1.4,42.2)
R2_1: length 73.7
  Top Layer w0.254: U1.77 32.24,2.9 31.04,1.7 19.69,1.7 13.73,7.65 v1(13.41,7.65) ; R9.1 v1(8.25,42.2)
  Inner1 w0.254: v1(13.41,7.65) 13.42,7.66 13.42,12.33 13.02,12.72 13.02,24.93 7.75,30.21 7.75,42.2 ; U5.5 8.13,51.35 8.13,43.6 7.75,43.22 7.75,42.2 ; 7.75,42.2 v1(8.25,42.2)
R2_2: length 77.7
  Top Layer w0.254: R13.1 v1(2.54,42.2) ; U1.78 32.74,2.9 31.18,1.34 19.54,1.34 13.81,7.07 13.17,7.07 10.58,9.66 10.58,12.63 v1(11,13.06)
  Inner1 w0.254: v1(11,13.06) 11,13.98 11.24,14.22 11.24,24.2 2.03,33.41 2.03,42.2 ; 2.03,42.2 2.03,51.35 U5.6 ; 2.03,42.2 v1(2.54,42.2)
R3_1: length 69.5
  Top Layer w0.254: U1.75 31.24,3.1 30.55,2.41 19.98,2.41 13.16,9.24 v1(12.84,9.24) ; R8.1 v1(7.11,42.2)
  Inner1 w0.254: 6.6,42.2 v1(7.11,42.2) ; 6.6,42.2 6.6,30.85 12.67,24.78 12.67,11.88 12.88,11.66 12.88,9.28 v1(12.84,9.24) ; 6.6,42.2 6.6,43.85 7.75,45 7.75,49.19 6.35,50.58
R3_2: length 72.2
  Top Layer w0.254: U1.76 31.74,3.1 30.7,2.05 19.84,2.05 13.24,8.65 12.59,8.65 11.13,10.11 11.13,11.84 11.16,11.87 v1(11.16,12.3) ; R12.1 v1(3.68,42.2)
  Inner1 w0.254: 3.81,50.58 3.81,49.71 2.63,48.53 2.63,46.81 3.17,46.27 3.17,42.2 ; 3.17,42.2 3.17,32.77 11.6,24.34 11.6,12.74 v1(11.16,12.3) ; 3.17,42.2 v1(3.68,42.2)
R4_1: length 64.3
  Top Layer w0.254: R7.1 v1(5.97,42.2) ; v1(12.3,11.1) 20.28,3.12 30.06,3.12 30.24,3.3 U1.73
  Inner1 w0.254: v1(12.3,11.1) 12.31,11.11 12.31,24.64 5.46,31.49 5.46,42.2 ; 5.46,42.2 v1(5.97,42.2) ; 5.46,42.2 5.46,44.49 6.35,45.38 U5.1
R4_2: length 66
  Top Layer w0.254: v1(11.72,11.6) 11.72,11.6 11.72,10.86 12.06,10.52 12.38,10.52 20.13,2.76 30.21,2.76 30.74,3.3 U1.74 ; R11.1 v1(4.83,42.2)
  Inner1 w0.254: v1(11.72,11.6) 11.96,11.84 11.96,24.49 4.32,32.13 4.32,42.2 ; 4.32,42.2 v1(4.83,42.2) ; 4.32,42.2 4.32,47.54 U5.2
R5_1: length 69.8
  Top Layer w0.254: v1(37.29,9.6) 37.24,9.55 U1.87 ; R24.1 v1(18.8,42.2)
  Inner1 w0.254: 18.29,42.2 18.29,53.38 U6.7 ; 18.29,42.2 18.29,39.73 18.21,39.65 18.21,39.17 18.29,39.09 18.29,14.47 22.68,10.08 33.6,10.08 34.14,9.54 37.23,9.54 v1(37.29,9.6) ; 18.29,42.2 v1(18.8,42.2)
R5_2: length 78.4
  Top Layer w0.254: v1(37.82,7.53) 37.74,7.45 U1.88 ; R28.1 v1(10.8,42.2)
  Inner1 w0.254: 10.39,42.2 10.39,52.59 U6.8 ; 10.39,42.2 v1(10.8,42.2) ; 10.39,42.2 10.39,40.34 11.07,39.66 11.07,33.18 15.8,28.46 15.8,11.75 15.62,11.58 15.62,10.01 20,5.64 35.93,5.64 v1(37.82,7.53)
R6_1: length 68.6
  Top Layer w0.254: R23.1 v1(17.65,42.2) ; U1.89 38.24,7.12 38.45,7.34 v1(38.45,8.64)
  Inner1 w0.254: 17.14,42.2 17.14,45 17.63,45.48 17.63,51.5 U6.5 ; 17.14,42.2 v1(17.65,42.2) ; 17.14,42.2 17.14,30.13 17.93,29.34 17.93,14.32 22.53,9.72 33.45,9.72 34.16,9.02 37.53,9.02 37.7,9.18 37.91,9.18 v1(38.45,8.64)
R6_2: length 60.8
  Top Layer w0.254: U1.70 23.08,7.66 v1(22.8,7.38) ; R27.1 v1(11.94,42.2)
  Inner1 w0.254: 11.43,42.2 11.43,33.33 16.15,28.6 16.15,11.61 15.98,11.44 15.98,10.16 18.76,7.38 v1(22.8,7.38) ; 11.43,42.2 v1(11.94,42.2) ; 11.43,42.2 11.43,51.09 U6.6
R7_1: length 55.1
  Top Layer w0.254: R22.1 v1(16.51,42.2) ; U1.69 19.44,8.16 v1(18.12,9.48)
  Inner1 w0.254: 16,50.58 17.27,49.31 17.27,45.63 16,44.36 16,42.2 ; 16,42.2 v1(16.51,42.2) ; 16,42.2 16,30.77 17.58,29.19 17.58,11.7 18.12,11.16 v1(18.12,9.48)
R7_2: length 56.9
  Top Layer w0.254: R26.1 v1(13.08,42.2) ; U1.68 26.14,8.66 v1(25.98,8.82)
  Inner1 w0.254: 12.57,42.2 12.57,32.69 16.51,28.75 16.51,11.46 16.34,11.29 16.34,10.3 17.82,8.82 v1(25.98,8.82) ; 12.57,42.2 12.57,44.74 11.94,45.38 11.94,49.06 13.46,50.58 ; 12.57,42.2 v1(13.08,42.2)
R8_1: length 51.7
  Top Layer w0.254: v1(17.52,10.07) 17.6,10.16 U1.65 ; R21.1 v1(15.37,42.2)
  Inner1 w0.254: 14.86,42.2 v1(15.37,42.2) ; 14.86,42.2 14.86,31.41 17.22,29.05 17.22,11.18 17.52,10.88 v1(17.52,10.07) ; 14.86,42.2 14.86,46.9 U6.1
R8_2: length 51.6
  Top Layer w0.254: U1.64 v1(16.92,10.66) ; R25.1 v1(14.22,42.2)
  Inner1 w0.254: 13.72,42.2 13.72,32.05 16.86,28.9 16.86,10.71 v1(16.92,10.66) ; 13.72,42.2 13.72,46.52 13.46,46.78 U6.2 ; 13.72,42.2 v1(14.22,42.2)
R9_1: length 53.3
  Top Layer w0.254: U1.63 29.4,11.16 v1(29.7,10.86) ; R80.1 v1(28.32,42.2)
  Inner1 w0.254: 27.81,42.2 v1(28.32,42.2) ; 27.81,42.2 27.81,53.51 U7.7 ; 27.81,42.2 27.81,39.73 27.64,39.55 27.64,33.6 23.36,29.32 23.36,20.79 25.08,19.07 25.08,15.48 v1(29.7,10.86)
R9_2: length 53.9
  Top Layer w0.254: v1(23.22,12.11) 23.5,12.39 23.5,12.4 23.76,12.66 U1.60 ; R84.1 v1(20.32,42.2)
  Inner1 w0.254: 19.81,42.2 19.81,40.21 20.6,39.42 20.6,20.27 19.52,19.19 19.52,15.76 23.17,12.11 v1(23.22,12.11) ; 19.81,42.2 19.81,52.36 U7.8 ; 19.81,42.2 v1(20.32,42.2)
R10_1: length 49.6
  Top Layer w0.254: v1(23.28,13.07) 23.4,13.19 27.21,13.19 27.22,13.19 28.15,13.19 U1.59 ; R79.1 v1(27.18,42.2)
  Inner1 w0.254: v1(23.28,13.07) 23.28,16.86 24.02,17.6 24.02,18.97 22.98,20 22.98,29.44 26.67,33.13 26.67,42.2 ; U7.5 27.19,51.59 27.19,46.28 26.67,45.76 26.67,42.2 ; 26.67,42.2 v1(27.18,42.2)
R10_2: length 49.5
  Top Layer w0.254: R83.1 v1(21.46,42.2) ; v1(20.82,15.42) 20.82,14.59 21.76,13.66 U1.58
  Inner1 w0.254: 20.95,42.2 v1(21.46,42.2) ; 20.95,42.2 20.95,20.12 19.88,19.04 19.88,16.36 v1(20.82,15.42) ; 20.95,42.2 20.95,50.97 U7.6
R11_1: length 47.7
  Top Layer w0.254: v1(21.66,14.58) 22.08,14.16 U1.57 ; R78.1 v1(26.03,42.2)
  Inner1 w0.254: 25.53,42.2 25.53,45.12 26.83,46.43 26.83,48.53 25.65,49.71 25.65,50.58 ; 25.53,42.2 25.53,32.5 22.62,29.59 22.62,19.86 23.66,18.82 23.66,17.79 21.66,15.79 v1(21.66,14.58) ; 25.53,42.2 v1(26.03,42.2)
R11_2: length 45.5
  Top Layer w0.254: v1(20.46,16.68) 22.48,14.66 U1.56 ; R82.1 v1(22.61,42.2)
  Inner1 w0.254: 22.1,42.2 22.1,44.87 21.59,45.38 21.59,49.06 23.11,50.58 ; 22.1,42.2 v1(22.61,42.2) ; 22.1,42.2 22.1,30.58 21.56,30.03 21.56,20.22 20.46,19.12 v1(20.46,16.68)
R12_1: length 42.8
  Top Layer w0.254: U1.55 22.88,15.16 v1(21.54,16.5) ; R77.1 v1(24.89,42.2)
  Inner1 w0.254: 24.38,42.2 24.38,31.86 22.27,29.74 22.27,19.7 23.3,18.66 23.3,18.18 21.63,16.5 v1(21.54,16.5) ; 24.38,42.2 v1(24.89,42.2) ; 24.38,42.2 24.38,46.78 U7.1
R12_2: length 37.8
  Top Layer w0.254: R81.1 v1(23.75,42.2) ; U1.50 23.48,17.66 v1(22.72,18.42)
  Inner1 w0.254: 23.24,42.2 v1(23.75,42.2) ; 23.24,42.2 23.24,46.14 23.11,46.27 U7.2 ; 23.24,42.2 23.24,31.22 21.91,29.89 21.91,19.23 v1(22.72,18.42)
R13_1: length 45.3
  Top Layer w0.254: v1(30,18.42) 29.74,18.16 U1.49 ; R88.1 v1(37.97,42.2)
  Inner1 w0.254: v1(30,18.42) 30,21.49 31.36,22.86 31.36,24.02 30.72,24.66 30.72,32.64 37.39,39.31 37.39,39.6 37.47,39.67 37.47,42.2 ; 37.47,42.2 37.47,43.6 37.59,43.73 37.59,53.38 U8.7 ; 37.47,42.2 v1(37.97,42.2)
R13_2: length 45.4
  Top Layer w0.254: v1(26.37,19.11) 26.82,18.66 28.18,18.66 U1.48 ; R92.1 v1(29.97,42.2)
  Inner1 w0.254: U8.8 29.46,52.36 29.46,42.2 ; 29.46,42.2 v1(29.97,42.2) ; 29.46,42.2 29.46,34.92 23.72,29.17 23.72,20.94 25.54,19.11 v1(26.37,19.11)
R14_1: length 39.6
  Top Layer w0.254: R87.1 v1(36.83,42.2) ; U1.41 29.84,22.16 v1(30,22.32)
  Inner1 w0.254: 36.32,42.2 36.32,45.38 37.08,46.14 37.08,51.35 U8.5 ; 36.32,42.2 v1(36.83,42.2) ; 36.32,42.2 36.32,38.75 28.56,30.98 28.56,22.8 29.04,22.32 v1(30,22.32)
R14_2: length 39.7
  Top Layer w0.254: v1(24.3,25.5) 24.3,22.91 24.55,22.66 U1.40 ; R91.1 v1(31.12,42.2)
  Inner1 w0.254: 30.61,42.2 30.56,42.25 30.56,50.92 U8.6 ; 30.61,42.2 30.61,35.56 26.78,31.73 26.78,27.2 25.08,25.5 v1(24.3,25.5) ; 30.61,42.2 v1(31.12,42.2)
R15_1: length 37.5
  Top Layer w0.254: R86.1 v1(35.69,42.2) ; U1.44 26.82,20.66 v1(26.58,20.9)
  Inner1 w0.254: 35.18,42.2 v1(35.69,42.2) ; 35.18,42.2 35.18,38.12 28.2,31.14 28.2,22.52 v1(26.58,20.9) ; 35.18,42.2 35.18,45.38 36.58,46.78 36.58,49.31 35.31,50.58
R15_2: length 39.3
  Top Layer w0.254: R90.1 v1(32.26,42.2) ; U1.45 25.32,20.16 v1(25.02,20.46)
  Inner1 w0.254: 32.77,50.58 31.24,49.06 31.24,46.14 31.75,45.63 31.75,42.2 ; 31.75,42.2 v1(32.26,42.2) ; 31.75,42.2 31.75,36.2 27.14,31.59 27.14,25.37 24.08,22.31 24.08,21.4 v1(25.02,20.46)
R16_1: length 44.9
  Top Layer w0.254: v1(26.34,22.07) 25.49,22.07 22.14,18.71 22.14,17.82 23.8,16.16 U1.53 ; R85.1 v1(34.54,42.2)
  Inner1 w0.254: 34.04,42.2 v1(34.54,42.2) ; 34.04,42.2 34.04,37.48 27.85,31.29 27.85,22.67 27.37,22.19 26.46,22.19 v1(26.34,22.07) ; 34.04,42.2 34.04,45.38 35.31,46.65 U8.1
R16_2: length 43.7
  Top Layer w0.254: v1(24.67,22.07) 21.78,19.18 21.78,17.68 23.8,15.66 U1.54 ; R89.1 v1(33.4,42.2)
  Inner1 w0.254: 32.89,42.2 v1(33.4,42.2) ; 32.89,42.2 32.89,46.78 32.77,46.9 U8.2 ; 32.89,42.2 32.89,36.84 27.49,31.44 27.49,24.9 v1(24.67,22.07)
R17_1: length 41.5
  Top Layer w0.254: U1.19 38.74,24.37 38.8,24.3 38.8,23.82 38.84,23.78 v1(38.84,23.5) ; R32.1 v1(47.62,42.2)
  Inner1 w0.254: 47.12,42.2 47.12,39.73 47.04,39.65 47.04,32.8 40.42,26.18 40.42,24.12 39.81,23.5 v1(38.84,23.5) ; 47.12,42.2 47.12,45.38 47.37,45.63 47.37,53.25 U9.7 ; 47.12,42.2 v1(47.62,42.2)
R17_2: length 44.1
  Top Layer w0.254: R36.1 v1(39.62,42.2) ; U1.20 38.24,24.08 v1(38.22,24.06)
  Inner1 w0.254: U9.8 39.12,52.36 39.12,42.2 ; 39.12,42.2 39.12,39.17 34.51,34.56 33.72,34.56 32.54,33.38 32.54,26.38 34.86,24.06 v1(38.22,24.06) ; 39.12,42.2 v1(39.62,42.2)
R18_1: length 37.5
  Top Layer w0.254: R31.1 v1(46.48,42.2) ; v1(37.66,24.64) 37.74,24.73 U1.21
  Inner1 w0.254: 45.97,42.2 v1(46.48,42.2) ; 45.97,42.2 45.97,32.24 41.04,27.31 38.59,27.31 37.66,26.38 v1(37.66,24.64) ; 45.97,42.2 45.97,45.38 46.74,46.14 46.74,51.35 U9.5
R18_2: length 32
  Top Layer w0.254: v1(37.62,28.96) 37.24,28.58 U1.22 ; R35.1 v1(40.77,42.2)
  Inner1 w0.254: 40.26,42.2 v1(40.77,42.2) ; 40.26,42.2 40.26,39.78 40.68,39.36 40.68,30.11 39.53,28.96 v1(37.62,28.96) ; 40.26,42.2 40.26,50.97 U9.6
R19_1: length 34
  Top Layer w0.254: R30.1 v1(45.34,42.2) ; v1(35.66,27.66) 35.24,27.25 U1.26
  Inner1 w0.254: 44.83,42.2 44.83,31.6 40.9,27.66 v1(35.66,27.66) ; 44.83,42.2 v1(45.34,42.2) ; 44.83,42.2 44.83,45.5 46.23,46.9 46.23,49.31 44.96,50.58
R19_2: length 35.2
  Top Layer w0.254: U1.27 34.74,28.08 33.18,29.64 33.18,34.38 33.84,35.04 v1(41.46,35.04) ; R34.1 v1(41.91,42.2)
  Inner1 w0.254: v1(41.46,35.04) 41.4,35.1 41.4,42.2 ; 41.4,42.2 41.4,43.35 41.02,43.73 41.02,49.19 42.42,50.58 ; 41.4,42.2 v1(41.91,42.2)
R20_1: length 31.8
  Top Layer w0.254: v1(34.15,27.84) 34.24,27.75 U1.28 ; R29.1 v1(44.2,42.2)
  Inner1 w0.254: 43.69,42.2 43.69,45.63 44.96,46.9 U9.1 ; 43.69,42.2 43.69,30.96 40.75,28.02 36.12,28.02 35.9,28.25 35.41,28.25 35.01,27.84 v1(34.15,27.84) ; 43.69,42.2 v1(44.2,42.2)
R20_2: length 31.9
  Top Layer w0.254: v1(33.12,27.96) 33.12,27.78 33.66,27.24 33.66,26.29 U1.29 ; R33.1 v1(43.05,42.2)
  Inner1 w0.254: 42.54,42.2 v1(43.05,42.2) ; 42.54,42.2 42.54,46.27 42.42,46.39 U9.2 ; 42.54,42.2 42.54,30.32 40.6,28.38 36.78,28.38 36.78,28.38 36.56,28.6 34.09,28.6 33.45,27.96 v1(33.12,27.96)
R21_1: length 43
  Top Layer w0.254: R40.1 v1(57.28,42.2) ; U1.15 40.74,27.9 45.72,32.88 v1(53.16,32.88)
  Inner1 w0.254: 56.77,42.2 56.77,44.23 57.02,44.49 57.02,53.25 U10.7 ; 56.77,42.2 v1(57.28,42.2) ; 56.77,42.2 56.77,42.01 56.17,41.42 56.17,36.71 53.16,33.7 v1(53.16,32.88)
R21_2: length 44.7
  Top Layer w0.254: v1(39.55,21.98) 39.55,23.82 39.26,24.12 39.26,26.19 U1.18 ; R44.1 v1(49.28,42.2)
  Inner1 w0.254: 48.77,42.2 v1(49.28,42.2) ; 48.77,42.2 48.74,42.18 48.74,33.5 41.14,25.89 41.14,23.82 39.55,22.24 v1(39.55,21.98) ; 48.77,42.2 48.74,42.23 48.74,52.34 U10.8
R22_1: length 39.2
  Top Layer w0.254: U1.13 41.74,27.89 45.53,31.68 v1(52.14,31.68) ; R39.1 v1(56.13,42.2)
  Inner1 w0.254: 55.63,42.2 v1(56.13,42.2) ; 55.63,42.2 55.63,44.36 56.51,45.25 56.51,51.22 U10.5 ; 55.63,42.2 55.63,36.67 52.14,33.18 v1(52.14,31.68)
R22_2: length 34.8
  Top Layer w0.254: R43.1 v1(50.42,42.2) ; v1(48.54,32.3) 48.31,32.52 45.87,32.52 41.24,27.9 U1.14
  Inner1 w0.254: 49.91,42.2 v1(50.42,42.2) ; 49.91,42.2 49.91,33.67 v1(48.54,32.3) ; 49.91,42.2 49.91,50.97 U10.6
R23_1: length 35.4
  Top Layer w0.254: R38.1 v1(54.99,42.2) ; v1(51.48,30.48) 45.33,30.48 42.74,27.89 U1.11
  Inner1 w0.254: 54.48,42.2 54.48,36.03 51.48,33.03 v1(51.48,30.48) ; 54.48,42.2 54.48,44.87 55.88,46.27 55.88,49.31 54.61,50.58 ; 54.48,42.2 v1(54.99,42.2)
R23_2: length 32.3
  Top Layer w0.254: U1.12 42.24,27.89 45.67,31.32 47.41,31.32 v1(47.64,31.1) ; R42.1 v1(51.56,42.2)
  Inner1 w0.254: 52.07,50.58 50.55,49.06 50.55,46.14 51.05,45.63 51.05,42.2 ; 51.05,42.2 v1(51.56,42.2) ; 51.05,42.2 51.05,34.11 49.9,32.96 49.9,32.6 48.4,31.1 v1(47.64,31.1)
R24_1: length 27.4
  Top Layer w0.254: R37.1 v1(53.85,42.2) ; v1(48.6,29.22) 47.46,29.22 46.24,28 U1.4
  Inner1 w0.254: 53.34,42.2 v1(53.85,42.2) ; 53.34,42.2 53.34,45.25 54.61,46.52 U10.1 ; 53.34,42.2 53.34,35.39 50.85,32.91 50.85,31.48 v1(48.6,29.22)
R24_2: length 26.2
  Top Layer w0.254: U1.5 45.74,28.17 v1(47.46,29.9) ; R41.1 v1(52.71,42.2)
  Inner1 w0.254: 52.2,42.2 52.2,45.89 52.07,46.01 U10.2 ; 52.2,42.2 52.2,34.75 50.26,32.81 50.26,32.45 47.7,29.9 v1(47.46,29.9) ; 52.2,42.2 v1(52.71,42.2)
R25_1: length 45.4
  Top Layer w0.254: v1(66.93,42.2) 66.93,42.2 R48.1 ; v1(60.84,31.98) 57.12,28.26 48.24,28.26 47.24,27.26 U1.2
  Inner1 w0.254: U11.7 66.8,53.12 66.8,43.85 66.42,43.47 66.42,42.2 v1(66.93,42.2) ; 66.41,42.29 66.41,40.53 60.82,34.94 60.84,34.92 v1(60.84,31.98)
R25_2: length 39.7
  Top Layer w0.254: R52.1 v1(58.93,42.2) ; U1.3 46.74,28 47.36,28.62 51.3,28.62 v1(53.94,31.26)
  Inner1 w0.254: 59.06,42.2 58.42,42.2 58.42,52.24 61.85,55.67 ; 58.44,42.24 58.44,36.08 53.94,31.58 v1(53.94,31.26)
R26_1: length 42.3
  Top Layer w0.254: v1(65.77,42.2) 65.79,42.19 R47.1 ; 49.79,22.16 50.9,22.16 51.9,23.16 54.42,23.16 v1(60.24,28.98)
  Inner1 w0.254: U11.5 66.17,51.22 66.17,44.74 65.28,43.85 65.28,42.2 v1(65.77,42.2) ; 65.26,42.4 65.26,39.88 60.26,34.88 60.26,29 v1(60.24,28.98)
R26_2: length 40.2
  Top Layer w0.254: v1(57.08,25) 56.76,25 54.57,22.8 52.05,22.8 50.9,21.66 49.79,21.66 ; R51.1 60.07,42.2
  Inner1 w0.254: v1(60.07,42.2) 59.56,42.2 59.56,50.97 U11.6 ; v1(57.08,25) 57.08,34.22 59.54,36.67 59.54,42.26
R27_1: length 40.9
  Top Layer w0.254: 49.79,20.66 53.84,20.66 v1(59.64,26.46) ; v1(64.63,42.2) 64.64,42.19 R46.1
  Inner1 w0.254: v1(64.63,42.2) 64.13,42.2 64.13,44.74 65.66,46.27 65.66,49.19 64.26,50.58 ; 64.14,42.18 64.14,39.27 59.64,34.77 v1(59.64,26.46)
R27_2: length 39.9
  Top Layer w0.254: v1(61.22,42.2) 61.21,42.2 R50.1 ; 49.79,20.16 53.94,20.16 57.64,23.86 v1(57.86,23.86)
  Inner1 w0.254: v1(61.22,42.2) 60.76,42.2 60.76,43.6 60.2,44.16 60.2,49.06 61.72,50.58 ; v1(57.86,23.86) 57.84,23.88 57.84,34.48 60.78,37.42 60.78,42.24
R28_1: length 38.7
  Top Layer w0.254: 49.79,19.66 54.49,19.66 58.45,23.61 58.45,24.37 v1(59.04,24.96) ; R45.1 v1(63.5,42.2)
  Inner1 w0.254: v1(63.5,42.2) 63.48,42.19 62.99,42.19 62.99,45.5 64.26,46.78 U11.1 ; v1(59.04,24.96) 59.04,28.2 59.28,28.44 59.28,34.91 63.01,38.64 63.01,42.25
R28_2: length 38.7
  Top Layer w0.254: v1(59.03,24) 59.03,23.69 54.5,19.16 49.79,19.16 ; R49.1 62.36,42.2 v1(62.35,42.2)
  Inner1 w0.254: U11.2 61.72,44.49 61.85,44.36 61.85,42.2 v1(62.35,42.2) ; 61.86,42.18 61.86,37.99 58.38,34.51 58.38,24.65 v1(59.03,24)
R29_1: length 58.4
  Top Layer w0.254: R56.1 76.58,42.19 v1(76.56,42.2) ; 49.79,18.66 54.5,18.66 58.94,23.1 67.56,23.1 75.9,31.44 v1(75.9,33.84)
  Inner1 w0.254: U12.7 76.45,53.12 76.45,44.66 76.07,44.28 76.07,42.2 v1(76.56,42.2) ; 76.08,42.18 76.08,39.73 76,39.65 76,39.17 76.08,39.08 76.08,34.02 v1(75.9,33.84)
R29_2: length 51.1
  Top Layer w0.254: R60.1 v1(68.58,42.2) ; v1(58.97,21.98) 56.14,19.14 55.49,19.14 54.63,18.28 53.94,18.28 53.81,18.16 49.79,18.16
  Inner1 w0.254: v1(68.58,42.2) 68.07,42.2 68.07,52.36 U12.8 ; v1(58.97,21.98) 68.04,31.04 68.04,42.24
R30_1: length 55.9
  Top Layer w0.254: v1(54.12,16.48) 52.79,15.16 49.79,15.16 ; R55.1 75.44,42.2 v1(75.44,42.2)
  Inner1 w0.254: U12.5 75.69,51.35 75.69,45.89 74.93,45.12 74.93,42.2 v1(75.44,42.2) ; 74.94,42.24 74.94,31.9 59.53,16.48 v1(54.12,16.48)
R30_2: length 51
  Top Layer w0.254: R59.1 69.72,42.2 ; v1(56.34,17.78) 53.22,14.66 49.79,14.66
  Inner1 w0.254: v1(69.72,42.2) 69.22,42.2 69.22,50.97 U12.6 ; 69.24,42.3 69.24,37.56 68.94,37.26 68.94,30.66 56.34,18.06 v1(56.34,17.78)
R31_1: length 53
  Top Layer w0.254: v1(57.24,17.13) 54.27,14.16 49.79,14.16 ; R54.1 74.29,42.2 v1(74.29,42.2)
  Inner1 w0.254: v1(74.29,42.2) 73.79,42.2 73.79,45.38 75.18,46.78 75.18,49.31 73.91,50.58 ; 73.8,42.24 73.8,40.11 71.04,37.35 71.04,28.5 59.67,17.13 v1(57.24,17.13)
R31_2: length 50.8
  Top Layer w0.254: v1(70.87,42.2) 70.87,42.19 R58.1 ; 49.79,13.66 55.24,13.66 58.38,16.8 v1(58.38,18.36)
  Inner1 w0.254: v1(70.87,42.2) 70.36,42.2 70.36,45.38 69.98,45.76 69.98,49.19 71.37,50.58 ; 70.38,42.18 70.38,38.2 69.3,37.11 69.3,29.91 58.38,19 v1(58.38,18.36)
R32_1: length 49.7
  Top Layer w0.254: R53.1 73.16,41.25 v1(73.16,42.2) ; v1(60.12,18.48) 59.1,17.46 59.08,17.46 58.86,17.23 58.86,16.77 55.38,13.3 51.53,13.3 51.39,13.16 49.79,13.16
  Inner1 w0.254: v1(73.16,42.2) 72.67,42.2 72.64,42.18 72.64,45.5 73.91,46.78 U12.1 ; v1(60.12,18.48) 70.68,29.04 70.68,37.49 72.66,39.47 72.66,42.3
R32_2: length 49.6
  Top Layer w0.254: 49.79,11.66 54.24,11.66 60.9,18.31 v1(60.9,20.28) ; v1(72,42.2) 72.01,42.2 R57.1
  Inner1 w0.254: U12.2 71.37,44.36 71.5,44.23 71.5,42.2 72,42.2 v1(72,42.2) ; 71.46,42.3 71.46,38.77 69.96,37.27 69.96,29.34 v1(60.9,20.28)
R33_1: length 72.6
  Top Layer w0.254: v1(72.3,17.16) 62.1,17.16 56.1,11.16 49.79,11.16 ; v1(86.23,42.2) 86.23,42.2 R64.1
  Inner1 w0.254: U13.7 86.11,53.12 86.11,44.87 85.72,44.49 85.72,42.2 v1(86.23,42.2) ; 85.74,42.24 85.74,41.98 83.97,40.21 82.64,40.21 80.01,37.57 80.01,32.42 72.31,24.73 72.31,17.17 v1(72.3,17.16)
R33_2: length 63.7
  Top Layer w0.254: v1(62.88,16.56) 62.4,16.56 56.5,10.66 49.79,10.66 ; R68.1 v1(78.23,42.2)
  Inner1 w0.254: v1(78.23,42.2) 77.72,42.2 77.72,52.36 U13.8 ; v1(62.88,16.56) 62.88,18.82 77.52,33.45 77.52,38.75 77.76,39 77.76,42.3
R34_1: length 72.9
  Top Layer w0.254: R63.1 v1(85.09,42.2) ; v1(67.26,8.34) 66.94,8.66 49.79,8.66
  Inner1 w0.254: U13.5 85.34,51.35 85.34,45.76 84.58,45 84.58,42.2 v1(85.09,42.2) ; 84.6,42.24 84.6,41.34 83.82,40.56 82.5,40.56 80.15,38.22 80.14,38.22 79.65,37.73 79.65,32.57 71.96,24.88 71.96,18.6 71.58,18.22 71.58,12.66 v1(67.26,8.34)
R34_2: length 66.7
  Top Layer w0.254: 49.79,8.16 62.02,8.16 v1(62.1,8.07) ; v1(79.38,42.2) 79.38,42.2 R67.1
  Inner1 w0.254: v1(79.38,42.2) 78.91,42.2 78.91,51.01 U13.6 ; 78.9,42.24 78.9,39.63 77.87,38.6 77.87,33.31 70.14,25.57 70.14,21.77 62.1,13.73 v1(62.1,8.07)
R35_1: length 69.6
  Top Layer w0.254: v1(83.94,42.2) 83.95,42.2 R62.1 ; 49.79,7.66 57.98,7.66 58.24,7.4 65.84,7.4 v1(66.36,7.92)
  Inner1 w0.254: v1(83.94,42.2) 83.44,42.2 83.44,45.38 84.84,46.78 84.84,49.31 83.57,50.58 ; 83.4,42.3 83.4,41.97 80.82,39.39 80.67,39.39 79.3,38.02 79.3,32.72 71.6,25.02 71.6,18.87 71.22,18.49 71.22,12.81 67.82,9.4 67.5,9.4 66.36,8.27 v1(66.36,7.92)
R35_2: length 66
  Top Layer w0.254: v1(62.52,6.82) 62.36,6.98 58.16,6.98 57.98,7.16 49.79,7.16 ; R66.1 80.52,42.2 v1(80.52,42.2)
  Inner1 w0.254: v1(80.52,42.2) 80.01,42.2 80.01,45.63 79.76,45.89 79.76,49.31 81.03,50.58 ; v1(62.52,6.82) 62.7,7 62.7,13.83 70.5,21.62 70.5,25.43 78.23,33.16 78.23,38.46 80.04,40.27 80.04,42.18
R36_1: length 73.7
  Top Layer w0.254: v1(68.28,16.08) 66.78,14.58 v1(61.92,14.58) ; U1.102 44.74,14.32 v1(44.94,14.52) ; R61.1 v1(82.8,42.2)
  Inner1 w0.254: v1(82.8,42.2) 82.3,42.2 82.3,42.21 82.3,45.89 83.57,47.16 U13.1 ; 82.32,42.18 82.32,41.54 78.94,38.16 78.94,32.86 71.22,25.14 71.22,19.02 v1(68.28,16.08) ; v1(61.92,14.58) 61.86,14.52 v1(44.94,14.52)
R36_2: length 72.7
  Top Layer w0.254: v1(62.46,15.66) 66,15.66 v1(66.24,15.9) ; v1(44.28,15.24) 44.24,15.2 U1.101 ; R65.1 81.66,42.2
  Inner1 w0.254: U13.2 81.03,44.36 81.15,44.23 81.15,42.2 v1(81.66,42.2) ; 81.18,42.18 81.18,40.91 78.58,38.31 78.58,33.01 70.86,25.29 70.86,21.48 66.24,16.86 v1(66.24,15.9) ; v1(44.28,15.24) 44.34,15.3 62.1,15.3 v1(62.46,15.66)
R37_1: length 97.6
  Top Layer w0.254: 84.88,29.1 85.83,29.1 v1(85.85,29.12) ; v1(44.64,1.36) 44.48,1.36 42.74,3.1 U1.98
  Inner1 w0.254: U14.7 95.09,53.66 95.09,46.98 89.84,41.73 89.84,33.11 86.38,29.65 ; 86.38,29.65 83.83,29.65 80.34,26.16 80.34,12.84 71.24,3.74 61.03,3.74 58.64,1.36 v1(44.64,1.36) ; 86.38,29.65 v1(85.85,29.12)
R37_2: length 99.8
  Top Layer w0.254: 84.88,37.1 85.83,37.1 v1(85.85,37.12) ; U1.97 v1(42.24,13.26)
  Inner1 w0.254: 86.4,37.67 85.37,37.67 83.88,36.18 83.88,34.86 83.88,34.86 83.88,33.96 82.24,32.32 82.24,31.58 77.85,27.19 77.85,13.87 70.21,6.23 61.36,6.23 55.97,11.62 50.94,11.62 49.32,13.24 42.25,13.24 v1(42.24,13.26) ; 86.4,37.67 v1(85.85,37.12) ; 86.4,37.67 87.35,38.62 87.35,52.46 U14.8
R38_1: length 97.9
  Top Layer w0.254: R71.1 85.83,30.25 v1(85.85,30.27) ; U1.93 40.24,2.22 v1(39.7,1.68)
  Inner1 w0.254: 86.39,30.8 89.48,33.89 89.48,41.88 94.74,47.13 94.74,51.48 U14.5 ; 86.39,30.8 84.48,30.8 79.98,26.31 79.98,12.99 71.09,4.1 60.88,4.1 58.72,1.94 39.96,1.94 v1(39.7,1.68) ; 86.39,30.8 v1(85.85,30.27)
R38_2: length 98.2
  Top Layer w0.254: R75.1 85.83,35.96 v1(85.85,35.98) ; U1.92 39.74,6.88 39.39,7.23 39.39,11.29 v1(39.6,11.5)
  Inner1 w0.254: 86.41,36.54 v1(85.85,35.98) ; 86.41,36.54 85.38,36.54 84.24,35.4 84.24,34.11 84.25,34.1 84.25,33.82 82.6,32.17 82.6,31.44 78.2,27.05 78.2,13.72 70.36,5.88 61.21,5.88 55.82,11.27 39.83,11.27 v1(39.6,11.5) ; 86.41,36.54 87.7,37.83 87.7,50.28 U14.6
R39_1: length 94.2
  Top Layer w0.254: R70.1 v1(85.85,31.39) ; U1.91 v1(39.24,2.3)
  Inner1 w0.254: 93.09,50.58 94.38,49.3 94.38,47.28 89.13,42.03 89.13,34.66 86.38,31.92 ; v1(39.24,2.3) 58.58,2.3 60.73,4.45 70.95,4.45 79.63,13.14 79.63,26.45 84.07,30.89 84.07,31.63 84.36,31.92 86.38,31.92 ; 86.38,31.92 v1(85.85,31.39)
R39_2: length 96.4
  Top Layer w0.254: R74.1 85.83,34.82 v1(85.85,34.84) ; v1(38.76,11.14) 39.04,10.86 39.04,7.42 38.74,7.12 U1.90
  Inner1 w0.254: 86.35,35.34 85.56,35.34 84.6,34.38 84.6,33.67 82.95,32.02 82.95,31.29 78.56,26.9 78.56,13.58 70.5,5.52 61.06,5.52 55.68,10.91 39.35,10.91 39.12,11.14 v1(38.76,11.14) ; 86.35,35.34 88.06,37.04 88.06,48.09 90.55,50.58 ; 86.35,35.34 v1(85.85,34.84)
R40_1: length 100.6
  Top Layer w0.254: 84.88,32.53 85.83,32.53 v1(85.85,32.55) ; v1(34.68,10.44) 33.9,9.66 U1.66
  Inner1 w0.254: v1(34.68,10.44) 34.92,10.2 55.38,10.2 60.77,4.81 70.8,4.81 79.27,13.28 79.27,26.6 83.66,31 83.66,31.73 85.05,33.11 86.09,33.11 86.31,33.33 86.63,33.33 ; 86.63,33.33 88.77,35.47 88.77,42.6 93.09,46.92 U14.1 ; 86.63,33.33 v1(85.85,32.55)
R40_2: length 99.1
  Top Layer w0.254: R73.1 85.83,33.67 v1(85.85,33.69) ; U1.67 34.25,9.16 v1(36.12,11.02)
  Inner1 w0.254: U14.2 88.41,45.91 88.41,36.26 86.3,34.14 ; 86.3,34.14 v1(85.85,33.69) ; 86.3,34.14 85.14,34.14 84.96,33.96 84.96,33.53 83.31,31.88 83.31,31.14 78.92,26.75 78.92,13.43 70.65,5.17 60.92,5.17 55.53,10.56 36.96,10.56 36.5,11.02 v1(36.12,11.02)
RESET: length 57.7
  Top Layer w0.254: R15.1 77.9,15.77 C24.2 77.89,17.53 SW1.3 77.92,24.79 77.27,25.44 72.06,25.44 69.24,22.62 v1(69.24,22.56) ; U1.25 35.74,22.6 v1(35.7,22.56)
  Inner2 w0.254: v1(35.7,22.56) v1(69.24,22.56)
SWCLK: length 55
  Top Layer w0.254: v1(51.54,5.88) 50.76,6.66 49.79,6.66 ; U4.3 4.36,8.76 6.78,8.76 8.76,6.78 v1(8.76,5.52)
  Inner1 w0.254: v1(51.54,5.88) 50.94,5.28 9,5.28 v1(8.76,5.52)
SWDIO: length 50
  Top Layer w0.254: U1.105 46.24,3.52 v1(45.6,2.88) ; v1(13.56,2.88) 2.81,13.63 U4.2
  Inner1 w0.254: v1(13.56,2.88) v1(45.6,2.88)
$2N2: length 2.4
  Top Layer w0.254: U3.8 85.65,13.37 R17.1
$2N4: length 7.5
  Top Layer w0.254: P1.2 90.97,12.1 U3.7
$2N5: length 7.5
  Top Layer w0.254: U3.6 90.97,10.83 P1.1
$2N12387: length 1.6
  Top Layer w0.254: LED4.1 R18.2
$2N12392: length 1.6
  Top Layer w0.254: LED5.1 R19.2
$2N12397: length 1.5
  Top Layer w0.254: R20.2 85.8,26.51 LED6.1

## Copper pours and planes (outline as drawn; the poured copper is in the pictures)
GND on Inner2: -1.78,71.54 99.06,71.54 99.06,-1.74 -1.78,-1.74
VCC3V3 on Top Layer: 80.65,25.44 89.41,25.44 89.41,16.93 80.65,16.93
VCC3V3 on Bottom Layer: -2.17,41.55 100.19,41.55 100.19,-3.66 -2.17,-3.66
VCC5V on Bottom Layer: 96.64,30.45 88.84,30.45 88.84,35.92 92.13,35.92 92.13,64.05 92,63.92 5.46,63.92 5.46,68.24 96.39,68.24 96.64,67.99

## Text on the board
Bottom Silkscreen Layer: Rimvydas
Top Silkscreen Layer: L1 | L2 | CAN_H | CAN_L | 2025-04-05 | DIO | CLK | GND | +5 | Reset | CAN | PixelGrid
